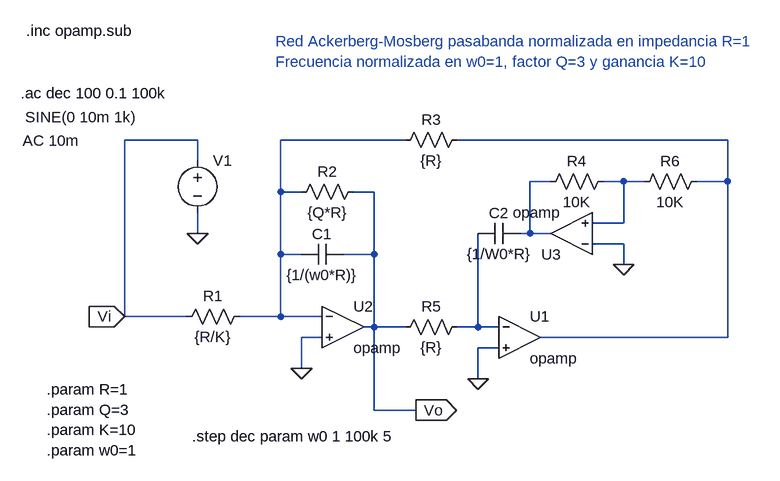
[diagram p0: schematic AK_MOS_2.asc]
AK_MOS_2.asc, the LTspice schematic file:
Version 4
SHEET 1 1476 680
WIRE -224 -176 -336 -176
WIRE 96 -176 -96 -176
WIRE 592 -176 176 -176
WIRE -224 -144 -224 -176
WIRE 320 -112 288 -112
WIRE 432 -112 400 -112
WIRE 464 -112 432 -112
WIRE 592 -112 592 -176
WIRE 592 -112 544 -112
WIRE -96 -96 -96 -176
WIRE -64 -96 -96 -96
WIRE 48 -96 16 -96
WIRE 432 -48 432 -112
WIRE 432 -48 384 -48
WIRE -224 -32 -224 -64
WIRE 288 -32 288 -112
WIRE 288 -32 272 -32
WIRE 320 -32 288 -32
WIRE 432 -16 384 -16
WIRE -96 0 -96 -96
WIRE -64 0 -96 0
WIRE 48 0 48 -96
WIRE 48 0 0 0
WIRE 432 16 432 -16
WIRE -336 96 -336 -176
WIRE -240 96 -336 96
WIRE -96 96 -96 0
WIRE -96 96 -160 96
WIRE -32 96 -96 96
WIRE 48 112 48 0
WIRE 48 112 32 112
WIRE 96 112 48 112
WIRE 208 112 208 -32
WIRE 208 112 176 112
WIRE 240 112 208 112
WIRE -32 128 -64 128
WIRE 592 128 592 -112
WIRE 592 128 304 128
WIRE 240 144 208 144
WIRE -64 176 -64 128
WIRE 208 192 208 144
WIRE 48 240 48 112
WIRE 112 240 48 240
FLAG 432 16 0
FLAG -64 176 0
FLAG 208 192 0
FLAG -224 -32 0
FLAG 112 240 Vo
IOPIN 112 240 Out
FLAG -336 96 Vi
IOPIN -336 96 In
SYMBOL res 80 128 R270
WINDOW 0 32 56 VTop 2
WINDOW 3 0 56 VBottom 2
SYMATTR InstName R5
SYMATTR Value {R}
SYMBOL res 416 -128 R90
WINDOW 0 0 56 VBottom 2
WINDOW 3 32 56 VTop 2
SYMATTR InstName R4
SYMATTR Value 10K
SYMBOL res 560 -128 R90
WINDOW 0 0 56 VBottom 2
WINDOW 3 32 56 VTop 2
SYMATTR InstName R6
SYMATTR Value 10K
SYMBOL res 192 -192 R90
WINDOW 0 0 56 VBottom 2
WINDOW 3 32 56 VTop 2
SYMATTR InstName R3
SYMATTR Value {R}
SYMBOL res 32 -112 R90
WINDOW 0 0 56 VBottom 2
WINDOW 3 32 56 VTop 2
SYMATTR InstName R2
SYMATTR Value {Q*R}
SYMBOL cap 0 -16 R90
WINDOW 0 0 32 VBottom 2
WINDOW 3 32 32 VTop 2
SYMATTR InstName C1
SYMATTR Value {1/(w0*R)}
SYMBOL cap 272 -48 R90
WINDOW 0 0 32 VBottom 2
WINDOW 3 32 32 VTop 2
SYMATTR InstName C2
SYMATTR Value {1/W0*R}
SYMBOL res -144 80 R90
WINDOW 0 0 56 VBottom 2
WINDOW 3 32 56 VTop 2
SYMATTR InstName R1
SYMATTR Value {R/K}
SYMBOL voltage -224 -160 R0
WINDOW 3 -265 -51 Left 2
WINDOW 123 -269 -15 Left 2
WINDOW 39 0 0 Left 0
SYMATTR Value SINE(0 10m 1k)
SYMATTR Value2 AC 10m
SYMATTR InstName V1
SYMBOL OpAmps\\opamp 272 64 R0
SYMATTR InstName U1
SYMBOL OpAmps\\opamp 0 48 R0
SYMATTR InstName U2
SYMBOL OpAmps\\opamp 352 32 R180
SYMATTR InstName U3
TEXT -456 208 Left 2 !.param R=1\n.param Q=3\n.param K=10\n.param w0=1
TEXT -496 -248 Left 2 !.ac dec 100 0.1 100k
TEXT -488 -344 Left 2 !.inc opamp.sub
TEXT -104 -328 Left 2 ;Red Ackerberg-Mosberg pasabanda normalizada en impedancia R=1\nFrecuencia normalizada en w0=1, factor Q=3 y ganancia K=10
TEXT -232 280 Left 2 !.step dec param w0 1 100k 5

The netlist it stands for:
* AK_MOS_2.asc
R5 Vo N005 {R}
R4 N004 N003 10K
R6 N002 N004 10K
R3 N002 N001 {R}
R2 Vo N001 {Q*R}
C1 Vo N001 {1/(w0*R)}
C2 N003 N005 {1/W0*R}
R1 N001 Vi {R/K}
V1 Vi 0 SINE(0 10m 1k) AC 10m
XU1 N005 0 N002 opamp Aol=100K GBW=10Meg  ; pins invin noninvin out
XU2 N001 0 Vo opamp Aol=100K GBW=10Meg  ; pins invin noninvin out
XU3 0 N004 N003 opamp Aol=100K GBW=10Meg  ; pins invin noninvin out
.param R=1
.param Q=3
.param K=10
.param w0=1
.ac dec 100 0.1 100k
.inc opamp.sub
* Red Ackerberg-Mosberg pasabanda normalizada en impedancia R=1
* Frecuencia normalizada en w0=1, factor Q=3 y ganancia K=10
.step dec param w0 1 100k 5
.backanno
.end